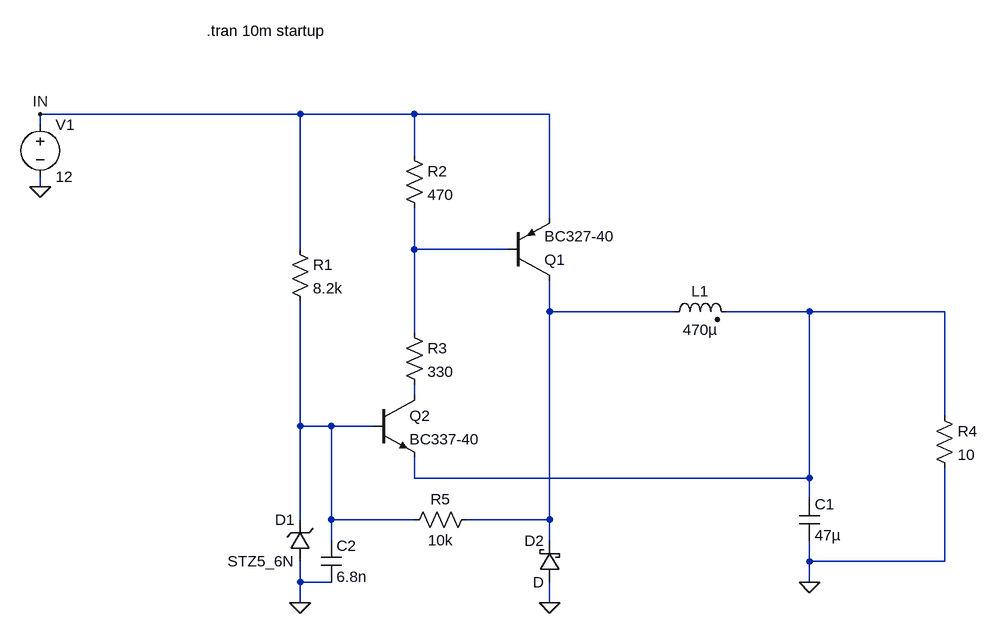
[diagram p0: schematic Discrete_only.asc]
Discrete_only.asc, the LTspice schematic file:
Version 4
SHEET 1 2900 680
WIRE 1600 -128 1200 -128
WIRE 1776 -128 1600 -128
WIRE 1984 -128 1776 -128
WIRE 1200 -112 1200 -128
WIRE 1776 -64 1776 -128
WIRE 1200 -16 1200 -32
WIRE 1984 32 1984 -128
WIRE 1600 80 1600 -128
WIRE 1776 80 1776 16
WIRE 1920 80 1776 80
WIRE 1984 176 1984 128
WIRE 2176 176 1984 176
WIRE 2384 176 2256 176
WIRE 2592 176 2384 176
WIRE 1776 208 1776 80
WIRE 1776 304 1776 288
WIRE 2592 336 2592 176
WIRE 1600 352 1600 160
WIRE 1648 352 1600 352
WIRE 1712 352 1648 352
WIRE 1776 432 1776 400
WIRE 2384 432 2384 176
WIRE 2384 432 1776 432
WIRE 2384 464 2384 432
WIRE 1600 496 1600 352
WIRE 1648 496 1648 352
WIRE 1776 496 1648 496
WIRE 1984 496 1984 176
WIRE 1984 496 1856 496
WIRE 1648 528 1648 496
WIRE 1984 528 1984 496
WIRE 2384 560 2384 528
WIRE 2592 560 2592 416
WIRE 2592 560 2384 560
WIRE 1600 592 1600 560
WIRE 1648 592 1600 592
WIRE 2384 592 2384 560
WIRE 1600 624 1600 592
WIRE 1984 624 1984 592
FLAG 1200 -16 0
FLAG 1200 -128 IN
FLAG 1600 624 0
FLAG 2384 592 0
FLAG 1984 624 0
SYMBOL VOLTAGE 1200 -128 R0
WINDOW 123 0 0 Left 2
WINDOW 39 0 0 Left 2
SYMATTR InstName V1
SYMATTR Value 12
SYMBOL res 1584 64 R0
SYMATTR InstName R1
SYMATTR Value 8.2k
SYMBOL res 1760 -80 R0
SYMATTR InstName R2
SYMATTR Value 470
SYMBOL res 1760 192 R0
SYMATTR InstName R3
SYMATTR Value 330
SYMBOL zener 1616 560 R180
WINDOW 0 24 64 Left 2
WINDOW 3 24 0 Left 2
SYMATTR InstName D1
SYMATTR Value STZ5_6N
SYMBOL pnp 1920 128 M180
SYMATTR InstName Q1
SYMATTR Value BC327-40
SYMBOL npn 1712 304 R0
SYMATTR InstName Q2
SYMATTR Value BC337-40
SYMBOL ind2 2160 192 R270
WINDOW 0 32 56 VTop 2
WINDOW 3 4 56 VBottom 2
SYMATTR InstName L1
SYMATTR Value 470µ
SYMATTR Type ind
SYMBOL cap 2368 464 R0
SYMATTR InstName C1
SYMATTR Value 47µ
SYMBOL cap 1632 528 R0
SYMATTR InstName C2
SYMATTR Value 6.8n
SYMBOL schottky 2000 592 R180
WINDOW 0 24 64 Left 2
WINDOW 3 24 0 Left 2
SYMATTR InstName D2
SYMBOL res 2576 320 R0
SYMATTR InstName R4
SYMATTR Value 10
SYMBOL res 1872 480 R90
WINDOW 0 0 56 VBottom 2
WINDOW 3 32 56 VTop 2
SYMATTR InstName R5
SYMATTR Value 10k
TEXT 1456 -256 Left 2 !.tran 10m startup

The netlist it stands for:
* Discrete_only.asc
V1 IN 0 12
R1 IN N005 8.2k
R2 IN N001 470
R3 N001 N004 330
D1 0 N005 STZ5_6N
Q1 N002 N001 IN 0 BC327-40
Q2 N004 N005 N003 0 BC337-40
L1 N002 N003 470µ
C1 N003 0 47µ
C2 N005 0 6.8n
D2 0 N002 D
R4 N003 0 10
R5 N002 N005 10k
.model D D
.lib standard.dio
.model NPN NPN
.model PNP PNP
.lib standard.bjt
.tran 10m startup
.backanno
.end